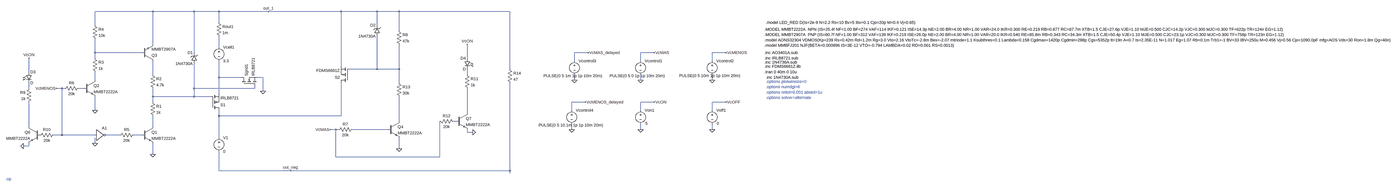
[diagram p0: schematic comparacion de valores celda 11.asc, whole sheet]
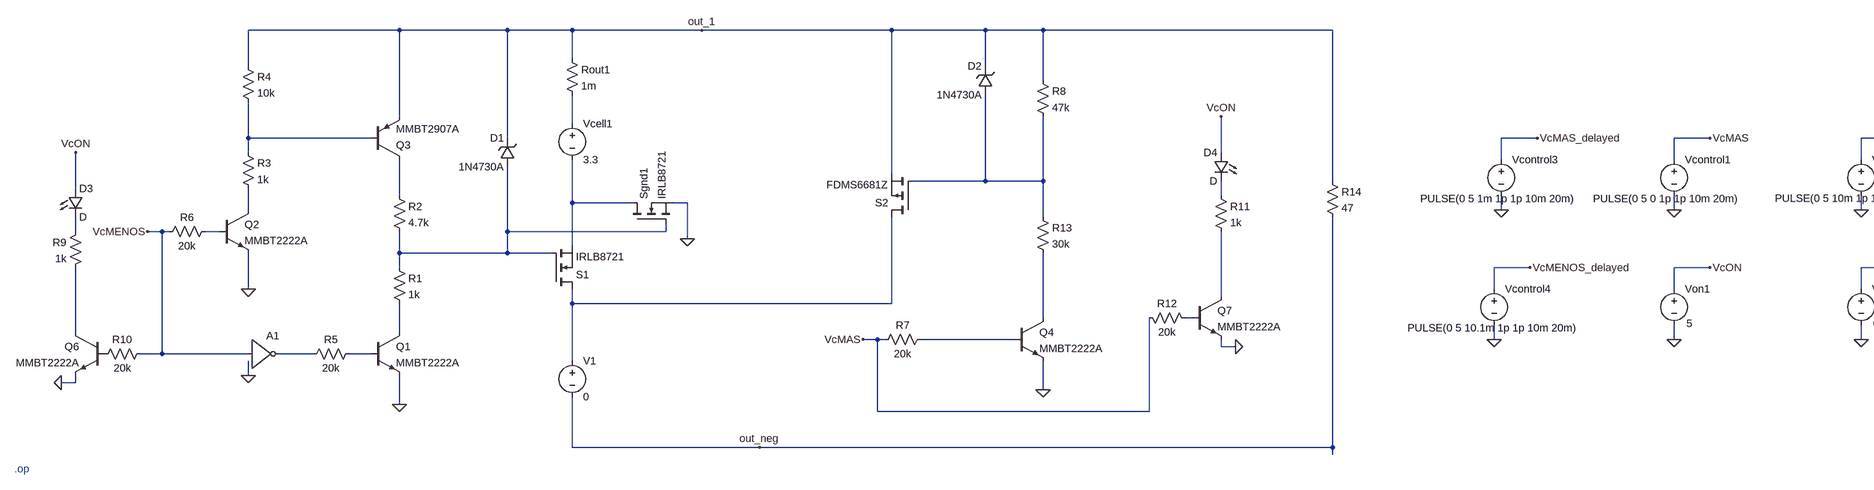
[diagram p1: schematic comparacion de valores celda 11.asc, part, row 1 of 1, column 1 of 2]
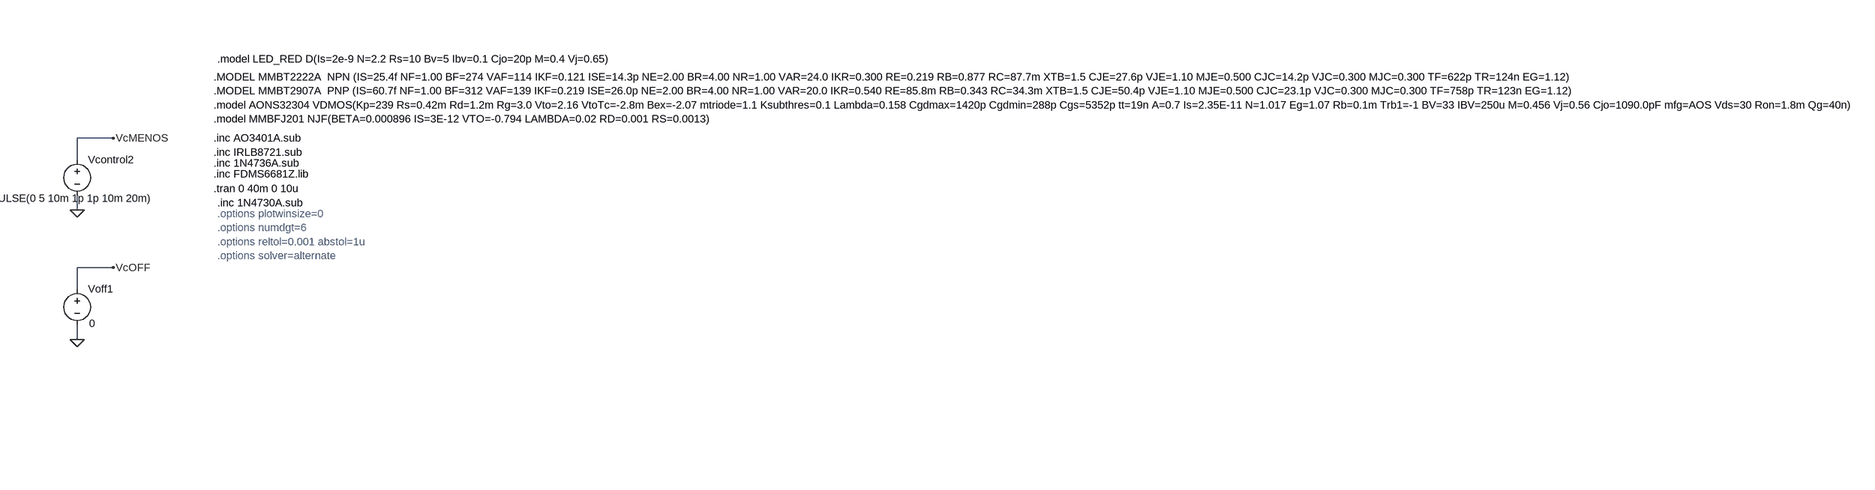
[diagram p2: schematic comparacion de valores celda 11.asc, part, row 1 of 1, column 2 of 2]
comparacion de valores celda 11.asc, the LTspice schematic file:
Version 4.1
SHEET 1 7580 680
WIRE -1376 -832 -1712 -832
WIRE -1136 -832 -1376 -832
WIRE -992 -832 -1136 -832
WIRE -704 -832 -992 -832
WIRE -160 -832 -704 -832
WIRE 48 -832 -160 -832
WIRE 176 -832 48 -832
WIRE 1088 -832 176 -832
WIRE -992 -768 -992 -832
WIRE -1712 -752 -1712 -832
WIRE 48 -752 48 -832
WIRE 176 -720 176 -832
WIRE -1376 -640 -1376 -832
WIRE -992 -624 -992 -688
WIRE -1712 -592 -1712 -672
WIRE -1440 -592 -1712 -592
WIRE -1136 -592 -1136 -832
WIRE 2368 -592 2288 -592
WIRE 2752 -592 2672 -592
WIRE 3168 -592 3088 -592
WIRE -1712 -560 -1712 -592
WIRE 752 -560 752 -640
WIRE 2288 -544 2288 -592
WIRE 2672 -544 2672 -592
WIRE 3088 -544 3088 -592
WIRE -160 -512 -160 -832
WIRE 48 -496 48 -688
WIRE 48 -496 -112 -496
WIRE 176 -496 176 -640
WIRE 176 -496 48 -496
WIRE 1088 -496 1088 -832
WIRE -2096 -480 -2096 -560
WIRE -1376 -464 -1376 -544
WIRE 752 -464 752 -496
WIRE -992 -448 -992 -544
WIRE -864 -448 -992 -448
WIRE -736 -448 -768 -448
WIRE -1712 -432 -1712 -480
WIRE 2288 -432 2288 -464
WIRE 2672 -432 2672 -464
WIRE 3088 -432 3088 -464
WIRE 176 -416 176 -496
WIRE -2096 -384 -2096 -416
WIRE -1904 -384 -1936 -384
WIRE -1888 -384 -1904 -384
WIRE -1776 -384 -1808 -384
WIRE -1136 -384 -1136 -528
WIRE -784 -384 -784 -400
WIRE -784 -384 -1136 -384
WIRE -736 -368 -736 -448
WIRE -992 -352 -992 -448
WIRE -1376 -336 -1376 -384
WIRE -1136 -336 -1136 -384
WIRE -1136 -336 -1376 -336
WIRE -1040 -336 -1136 -336
WIRE -1376 -304 -1376 -336
WIRE 2352 -304 2272 -304
WIRE 2752 -304 2672 -304
WIRE 3168 -304 3088 -304
WIRE -1712 -256 -1712 -336
WIRE 2272 -256 2272 -304
WIRE 2672 -256 2672 -304
WIRE 3088 -256 3088 -304
WIRE 752 -240 752 -384
WIRE -992 -224 -992 -256
WIRE -160 -224 -160 -416
WIRE -160 -224 -992 -224
WIRE 176 -192 176 -336
WIRE 688 -192 672 -192
WIRE -2096 -160 -2096 -304
WIRE -1376 -160 -1376 -224
WIRE -192 -144 -224 -144
WIRE -176 -144 -192 -144
WIRE 112 -144 -96 -144
WIRE 2272 -144 2272 -176
WIRE 2672 -144 2672 -176
WIRE 3088 -144 3088 -176
WIRE 752 -128 752 -144
WIRE 784 -128 752 -128
WIRE -1904 -112 -1904 -384
WIRE -1904 -112 -1952 -112
WIRE -1712 -112 -1904 -112
WIRE -1568 -112 -1648 -112
WIRE -1440 -112 -1488 -112
WIRE -992 -96 -992 -224
WIRE -1712 -64 -1712 -96
WIRE -2096 -48 -2096 -64
WIRE -2096 -48 -2128 -48
WIRE 176 -32 176 -96
WIRE -1376 0 -1376 -64
WIRE -192 16 -192 -144
WIRE 592 16 592 -192
WIRE 592 16 -192 16
WIRE -992 96 -992 -16
WIRE -576 96 -992 96
WIRE 1088 96 1088 -416
WIRE 1088 96 -576 96
WIRE 1088 112 1088 96
FLAG -1712 -256 0
FLAG -1376 0 0
FLAG -1936 -384 VcMENOS
FLAG -576 96 out_neg
FLAG -704 -832 out_1
FLAG 176 -32 0
FLAG -224 -144 VcMAS
FLAG -736 -368 0
FLAG -1712 -64 0
FLAG -2128 -48 0
FLAG 784 -128 0
FLAG 752 -640 VcON
FLAG -2096 -560 VcON
FLAG 2672 -432 0
FLAG 3088 -432 0
FLAG 2752 -592 VcMAS
FLAG 3168 -592 VcMENOS
FLAG 3088 -144 0
FLAG 3168 -304 VcOFF
FLAG 2672 -144 0
FLAG 2752 -304 VcON
FLAG 2288 -432 0
FLAG 2368 -592 VcMAS_delayed
FLAG 2272 -144 0
FLAG 2352 -304 VcMENOS_delayed
SYMBOL npn -1440 -160 R0
SYMATTR InstName Q1
SYMATTR Value MMBT2222A
SYMBOL res -1392 -320 R0
SYMATTR InstName R1
SYMATTR Value 1k
SYMBOL res -1392 -480 R0
SYMATTR InstName R2
SYMATTR Value 4.7k
SYMBOL npn -1776 -432 R0
SYMATTR InstName Q2
SYMATTR Value MMBT2222A
SYMBOL res -1728 -576 R0
SYMATTR InstName R3
SYMATTR Value 1k
SYMBOL res -1728 -768 R0
SYMATTR InstName R4
SYMATTR Value 10k
SYMBOL res -1472 -128 R90
WINDOW 0 0 56 VBottom 2
WINDOW 3 32 56 VTop 2
SYMATTR InstName R5
SYMATTR Value 20k
SYMBOL voltage -992 -640 R0
WINDOW 123 0 0 Left 0
WINDOW 39 0 0 Left 0
SYMATTR InstName Vcell1
SYMATTR Value 3.3
SYMBOL pnp -1440 -544 M180
SYMATTR InstName Q3
SYMATTR Value MMBT2907A
SYMBOL nmos -1040 -256 M180
SYMATTR InstName S1
SYMATTR Value IRLB8721
SYMATTR Prefix X
SYMBOL res -1792 -400 R90
WINDOW 0 0 56 VBottom 2
WINDOW 3 32 56 VTop 2
SYMATTR InstName R6
SYMATTR Value 20k
SYMBOL res -1008 -784 R0
SYMATTR InstName Rout1
SYMATTR Value 1m
SYMBOL npn 112 -192 R0
SYMATTR InstName Q4
SYMATTR Value MMBT2222A
SYMBOL res -80 -160 R90
WINDOW 0 0 56 VBottom 2
WINDOW 3 32 56 VTop 2
SYMATTR InstName R7
SYMATTR Value 20k
SYMBOL res 160 -736 R0
SYMATTR InstName R8
SYMATTR Value 47k
SYMBOL zener -1120 -528 R180
WINDOW 0 24 64 Left 2
WINDOW 3 24 0 Left 2
SYMATTR InstName D1
SYMATTR Value 1N4730A
SYMATTR Prefix X
SYMBOL zener 64 -688 R180
WINDOW 0 24 64 Left 2
WINDOW 3 24 0 Left 2
SYMATTR InstName D2
SYMATTR Value 1N4730A
SYMATTR Prefix x
SYMBOL nmos -864 -400 R270
SYMATTR InstName Sgnd1
SYMATTR Value IRLB8721
SYMATTR Prefix X
SYMBOL Digital\\inv -1712 -176 R0
SYMATTR InstName A1
SYMBOL pmos -112 -416 R180
SYMATTR InstName S2
SYMATTR Value FDMS6681Z
SYMATTR Prefix X
SYMBOL voltage -992 -112 R0
WINDOW 123 0 0 Left 0
WINDOW 39 0 0 Left 0
SYMATTR InstName V1
SYMATTR Value 0
SYMBOL npn -2032 -160 M0
SYMATTR InstName Q6
SYMATTR Value MMBT2222A
SYMBOL res -2080 -400 M0
SYMATTR InstName R9
SYMATTR Value 1k
SYMBOL res -1936 -128 R90
WINDOW 0 0 56 VBottom 2
WINDOW 3 32 56 VTop 2
SYMATTR InstName R10
SYMATTR Value 20k
SYMBOL LED -2112 -480 R0
SYMATTR InstName D3
SYMBOL npn 688 -240 R0
SYMATTR InstName Q7
SYMATTR Value MMBT2222A
SYMBOL res 736 -480 R0
SYMATTR InstName R11
SYMATTR Value 1k
SYMBOL res 576 -208 M90
WINDOW 0 0 56 VBottom 2
WINDOW 3 32 56 VTop 2
SYMATTR InstName R12
SYMATTR Value 20k
SYMBOL LED 768 -560 M0
SYMATTR InstName D4
SYMBOL res 160 -432 R0
SYMATTR InstName R13
SYMATTR Value 30k
SYMBOL res 1072 -512 R0
SYMATTR InstName R14
SYMATTR Value 47
SYMBOL voltage 2672 -560 R0
WINDOW 3 -180 103 Left 2
WINDOW 123 0 0 Left 0
WINDOW 39 0 0 Left 0
SYMATTR Value PULSE(0 5 0 1p 1p 10m 20m)
SYMATTR InstName Vcontrol1
SYMBOL voltage 3088 -560 R0
WINDOW 3 -192 102 Left 2
WINDOW 123 0 0 Left 0
WINDOW 39 0 0 Left 0
SYMATTR Value PULSE(0 5 10m 1p 1p 10m 20m)
SYMATTR InstName Vcontrol2
SYMBOL voltage 3088 -272 R0
WINDOW 3 27 92 Left 2
WINDOW 123 0 0 Left 0
WINDOW 39 0 0 Left 0
SYMATTR Value 0
SYMATTR InstName Voff1
SYMBOL voltage 2672 -272 R0
WINDOW 3 28 92 Left 2
WINDOW 123 0 0 Left 0
WINDOW 39 0 0 Left 0
SYMATTR Value 5
SYMATTR InstName Von1
SYMBOL voltage 2288 -560 R0
WINDOW 3 -180 103 Left 2
WINDOW 123 0 0 Left 0
WINDOW 39 0 0 Left 0
SYMATTR Value PULSE(0 5 1m 1p 1p 10m 20m)
SYMATTR InstName Vcontrol3
SYMBOL voltage 2272 -272 R0
WINDOW 3 -192 102 Left 2
WINDOW 123 0 0 Left 0
WINDOW 39 0 0 Left 0
SYMATTR Value PULSE(0 5 10.1m 1p 1p 10m 20m)
SYMATTR InstName Vcontrol4
TEXT -2232 144 Left 2 ;.op
TEXT 3600 -480 Left 2 !.tran 0 40m 0 10u
TEXT 3600 -728 Left 2 !.MODEL MMBT2222A  NPN (IS=25.4f NF=1.00 BF=274 VAF=114 IKF=0.121 ISE=14.3p NE=2.00 BR=4.00 NR=1.00 VAR=24.0 IKR=0.300 RE=0.219 RB=0.877 RC=87.7m XTB=1.5 CJE=27.6p VJE=1.10 MJE=0.500 CJC=14.2p VJC=0.300 MJC=0.300 TF=622p TR=124n EG=1.12)\n.MODEL MMBT2907A  PNP (IS=60.7f NF=1.00 BF=312 VAF=139 IKF=0.219 ISE=26.0p NE=2.00 BR=4.00 NR=1.00 VAR=20.0 IKR=0.540 RE=85.8m RB=0.343 RC=34.3m XTB=1.5 CJE=50.4p VJE=1.10 MJE=0.500 CJC=23.1p VJC=0.300 MJC=0.300 TF=758p TR=123n EG=1.12)\n.model AONS32304 VDMOS(Kp=239 Rs=0.42m Rd=1.2m Rg=3.0 Vto=2.16 VtoTc=-2.8m Bex=-2.07 mtriode=1.1 Ksubthres=0.1 Lambda=0.158 Cgdmax=1420p Cgdmin=288p Cgs=5352p tt=19n A=0.7 Is=2.35E-11 N=1.017 Eg=1.07 Rb=0.1m Trb1=-1 BV=33 IBV=250u M=0.456 Vj=0.56 Cjo=1090.0pF mfg=AOS Vds=30 Ron=1.8m Qg=40n)\n.model MMBFJ201 NJF(BETA=0.000896 IS=3E-12 VTO=-0.794 LAMBDA=0.02 RD=0.001 RS=0.0013)
TEXT 3600 -592 Left 2 !.inc AO3401A.sub\n.inc IRLB8721.sub
TEXT 3600 -536 Left 2 !.inc 1N4736A.sub
TEXT 3608 -424 Left 2 ;.options plotwinsize=0\n.options numdgt=6\n.options reltol=0.001 abstol=1u\n.options solver=alternate
TEXT 3600 -512 Left 2 !.inc FDMS6681Z.lib
TEXT 3608 -448 Left 2 !.inc 1N4730A.sub
TEXT 3608 -768 Left 2 !.model LED_RED D(Is=2e-9 N=2.2 Rs=10 Bv=5 Ibv=0.1 Cjo=20p M=0.4 Vj=0.65)

The netlist it stands for:
* comparacion de valores celda 11.asc
Q1 N016 N019 0 0 MMBT2222A
R1 N010 N016 1k
R2 N004 N010 4.7k
Q2 N007 N009 0 0 MMBT2222A
R3 N002 N007 1k
R4 out_1 N002 10k
R5 N019 N018 20k
Vcell1 N001 N006 3.3
Q3 N004 N002 out_1 0 MMBT2907A
X§S1 N012 N010 N006 IRLB8721  ; pins D G S
R6 N009 VcMENOS 20k
Rout1 out_1 N001 1m
Q4 N013 N017 0 0 MMBT2222A
R7 N017 VcMAS 20k
R8 out_1 N003 47k
X§D1 N010 out_1 1N4730A  ; pins + -
X§D2 N003 out_1 1N4730A  ; pins + -
X§Sgnd1 N006 N010 0 IRLB8721  ; pins D G S
A1 VcMENOS 0 0 0 0 N018 0 0 BUF
X§S2 N012 N003 out_1 FDMS6681Z  ; pins D G S
V1 N012 out_neg 0
Q6 N015 P001 0 0 MMBT2222A
R9 N008 N015 1k
R10 VcMENOS P001 20k
D3 VcON N008 D
Q7 N011 N014 0 0 MMBT2222A
R11 N005 N011 1k
R12 VcMAS N014 20k
D4 VcON N005 D
R13 N003 N013 30k
R14 out_1 out_neg 47
Vcontrol1 VcMAS 0 PULSE(0 5 0 1p 1p 10m 20m)
Vcontrol2 VcMENOS 0 PULSE(0 5 10m 1p 1p 10m 20m)
Voff1 VcOFF 0 0
Von1 VcON 0 5
Vcontrol3 VcMAS_delayed 0 PULSE(0 5 1m 1p 1p 10m 20m)
Vcontrol4 VcMENOS_delayed 0 PULSE(0 5 10.1m 1p 1p 10m 20m)
.model D D
.lib standard.dio
.model NPN NPN
.model PNP PNP
.lib standard.bjt
* .op
.tran 0 40m 0 10u
.MODEL MMBT2222A  NPN (IS=25.4f NF=1.00 BF=274 VAF=114 IKF=0.121 ISE=14.3p NE=2.00 BR=4.00 NR=1.00 VAR=24.0 IKR=0.300 RE=0.219 RB=0.877 RC=87.7m XTB=1.5 CJE=27.6p VJE=1.10 MJE=0.500 CJC=14.2p VJC=0.300 MJC=0.300 TF=622p TR=124n EG=1.12)
.MODEL MMBT2907A  PNP (IS=60.7f NF=1.00 BF=312 VAF=139 IKF=0.219 ISE=26.0p NE=2.00 BR=4.00 NR=1.00 VAR=20.0 IKR=0.540 RE=85.8m RB=0.343 RC=34.3m XTB=1.5 CJE=50.4p VJE=1.10 MJE=0.500 CJC=23.1p VJC=0.300 MJC=0.300 TF=758p TR=123n EG=1.12)
.model AONS32304 VDMOS(Kp=239 Rs=0.42m Rd=1.2m Rg=3.0 Vto=2.16 VtoTc=-2.8m Bex=-2.07 mtriode=1.1 Ksubthres=0.1 Lambda=0.158 Cgdmax=1420p Cgdmin=288p Cgs=5352p tt=19n A=0.7 Is=2.35E-11 N=1.017 Eg=1.07 Rb=0.1m Trb1=-1 BV=33 IBV=250u M=0.456 Vj=0.56 Cjo=1090.0pF mfg=AOS Vds=30 Ron=1.8m Qg=40n)
.model MMBFJ201 NJF(BETA=0.000896 IS=3E-12 VTO=-0.794 LAMBDA=0.02 RD=0.001 RS=0.0013)
.inc AO3401A.sub
.inc IRLB8721.sub
.inc 1N4736A.sub
* .options plotwinsize=0
* .options numdgt=6
* .options reltol=0.001 abstol=1u
* .options solver=alternate
.inc FDMS6681Z.lib
.inc 1N4730A.sub
.model LED_RED D(Is=2e-9 N=2.2 Rs=10 Bv=5 Ibv=0.1 Cjo=20p M=0.4 Vj=0.65)
.backanno
.end